# EAGLE design shield (EAGLE 9.6.2)
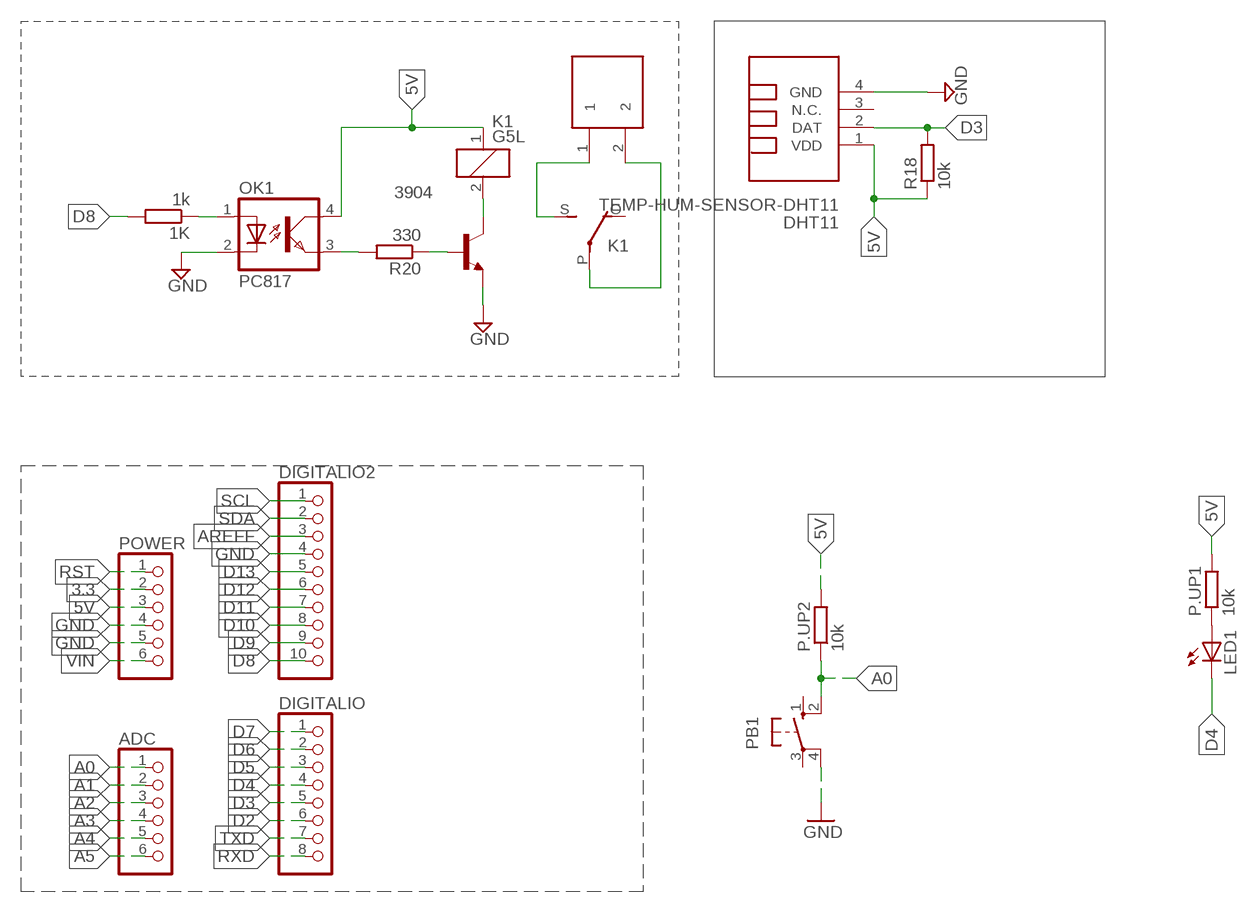
[diagram p0: schematic, sheet 1]

## Parts
1K  1k  R-EU_R0805  [R0805]
3904  MMBT3904LT1-NPN-SOT23-BEC  [SOT23-BEC]
ADC  PINHD-1X6  [1X06]
DHT11  TEMP-HUM-SENSOR-DHT11  [TEMP-HUM-SENSOR-DHT11]
DIGITALIO  PINHD-1X8  [1X08]
DIGITALIO2  PINHD-1X10  [1X10]
K1  G5L  [G5LE]
LED1  LED5MM  [LED5MM]
OK1  PC817  [DIL04]
P.UP1  10k  R-EU_R0805  [R0805]
P.UP2  10k  R-EU_R0805  [R0805]
PB1  10-XX  [B3F-10XX]
POWER  PINHD-1X6  [1X06]
R18  10k  R-EU_R0805  [R0805]
R20  330  R-EU_R0805  [R0805]
U$8  TBLOCK2PIN  [2PIN]

## Nets
3.3: POWER.2
5V: DHT11.1(VDD) K1.1 OK1.4(COL) P.UP1.2 P.UP2.2 POWER.3 R18.1
A0: ADC.1 P.UP2.1 PB1.2(S1)
A1: ADC.2
A2: ADC.3
A3: ADC.4
A4: ADC.5
A5: ADC.6
AREFF: DIGITALIO2.3
D2: DIGITALIO.6
D3: DHT11.2(DAT) DIGITALIO.5 R18.2
D4: DIGITALIO.4 LED1.K(C)
D5: DIGITALIO.3
D6: DIGITALIO.2
D7: DIGITALIO.1
D8: 1K.2 DIGITALIO2.10
D9: DIGITALIO2.9
D10: DIGITALIO2.8
D11: DIGITALIO2.7
D12: DIGITALIO2.6
D13: DIGITALIO2.5
GND: 3904.E DHT11.4(GND) DIGITALIO2.4 OK1.2(C) PB1.4(P1) POWER.4 POWER.5
LOAD: K1.P(2:P) U$8.2
N$1: K1.S(2:S) U$8.1
N$2: LED1.A P.UP1.1
N$13: 1K.1 OK1.1(A)
N$14: OK1.3(EMIT) R20.2
N$15: 3904.B R20.1
N$16: 3904.C K1.2
RST: POWER.1
RXD: DIGITALIO.8
SCL: DIGITALIO2.1
SDA: DIGITALIO2.2
TXD: DIGITALIO.7
VIN: POWER.6
Unconnected: DHT11.3(N.C.) K1.O(2:O) PB1.1(S) PB1.3(P)

## Library data of the parts
1K R18 R20 = rcl:R-EU_: RESISTOR, European symbol
3904 = transistor-neu-to92:*-NPN-: NPN Transistror
ADC POWER = pinhead:PINHD-1X6: PIN HEADER
DHT11 = diy-modules:TEMP-HUM-SENSOR-DHT11: DHT11 - digital humidity & temperature sensor DHT11 datasheet available here: https://akizukidenshi.com/download/ds/aosong/DHT11.pdf Click here to find device on ebay.com <http://www.ebay.com/sch/dht11+digital+sensor>
DIGITALIO = pinhead:PINHD-1X8: PIN HEADER
DIGITALIO2 = pinhead:PINHD-1X10: PIN HEADER
K1 = relay:G5L: RELAY 1 x switch, 10 A/120 V AC, 8 A/30 V ADC, Omron; OC_FARNELL: unknown; OC_NEWARK: unknown
LED1 = led:LED: LED OSRAM: - CHIPLED LG R971, LG N971, LY N971, LG Q971, LY Q971, LO R971, LY R971 LH N974, LH R974 LS Q976, LO Q976, LY Q976 LO Q996 - Hyper CHIPLED LW Q18S LB Q993, LB Q99A, LB R99A - SideLED LS A670, LO A670, LY A670, LG A670, LP A670 LB A673, LV A673, LT A673, LW A673 LH A674 LY A675 LS A676, LA A676, LO A676, LY A676, LW A676 LS A679, LY A679, LG A679 - Hyper Micro SIDELED® LS Y876, LA Y876, LO Y876, LY Y876 LT Y87S - SmartLED LW L88C, LW L88S LB L89C, LB L89S, LG L890 LS L89K, LO L89K, LY L89K LS L896, LA L896, LO L896, LY L896 - TOPLED LS T670, LO T670, LY T670, LG T670, LP T670 LSG T670, LSP T670, LSY T670, LOP T670, LYG T670 LG T671, LOG T671, LSG T671 LB T673, LV T673, LT T673, LW T673 LH T674 LS T676, LA T676, LO T676, LY T676, LB T676, LH T676, LSB T676, LW T676 LB T67C, LV T67C, LT T67C, LS T67K, LO T67K, LY T67K, LW E67C LS E67B, LA E67B, LO E67B, LY E67B, LB E67C, LV E67C, LT E67C LW T67C LS T679, LY T679, LG T679 LS T770, LO T770, LY T770, LG T770, LP T770 LB T773, LV T773, LT T773, LW T773 LH T774 LS E675, LA E675, LY E675, LS T675 LS T776, LA T776, LO T776, LY T776, LB T776 LHGB T686 LT T68C, LB T68C - Hyper Mini TOPLED® LB M676 - Mini TOPLED Santana® LG M470 LS M47K, LO M47K, LY M47K Source: http://www.osram.convergy.de LUXEON: - LUMILED® LXK2-PW12-R00, LXK2-PW12-S00, LXK2-PW14-U00, LXK2-PW14-V00 LXK2-PM12-R00, LXK2-PM12-S00, LXK2-PM14-U00 LXK2-PE12-Q00, LXK2-PE12-R00, LXK2-PE12-S00, LXK2-PE14-T00, LXK2-PE14-U00 LXK2-PB12-K00, LXK2-PB12-L00, LXK2-PB12-M00, LXK2-PB14-N00, LXK2-PB14-P00, LXK2-PB14-Q00 LXK2-PR12-L00, LXK2-PR12-M00, LXK2-PR14-Q00, LXK2-PR14-R00 LXK2-PD12-Q00, LXK2-PD12-R00, LXK2-PD12-S00 LXK2-PH12-R00, LXK2-PH12-S00 LXK2-PL12-P00, LXK2-PL12-Q00, LXK2-PL12-R00 Source: www.luxeon.com KINGBRIGHT: KA-3528ASYC Source: www.kingbright.com
OK1 = optocoupler:PC817: SHARP OPTO COUPLER; MPN: PC817X4J000F; OC_FARNELL: 9707727; OC_NEWARK: 97K7059
P.UP1 P.UP2 = resistor:R-EU_: RESISTOR, European symbol
PB1 = switch-omron:10-XX: OMRON SWITCH; MPN: B3F-1000; OC_FARNELL: 176432; OC_NEWARK: 36M3542
U$8 = Terminal Block 1.1mm hole:TBLOCK2PIN

## Board
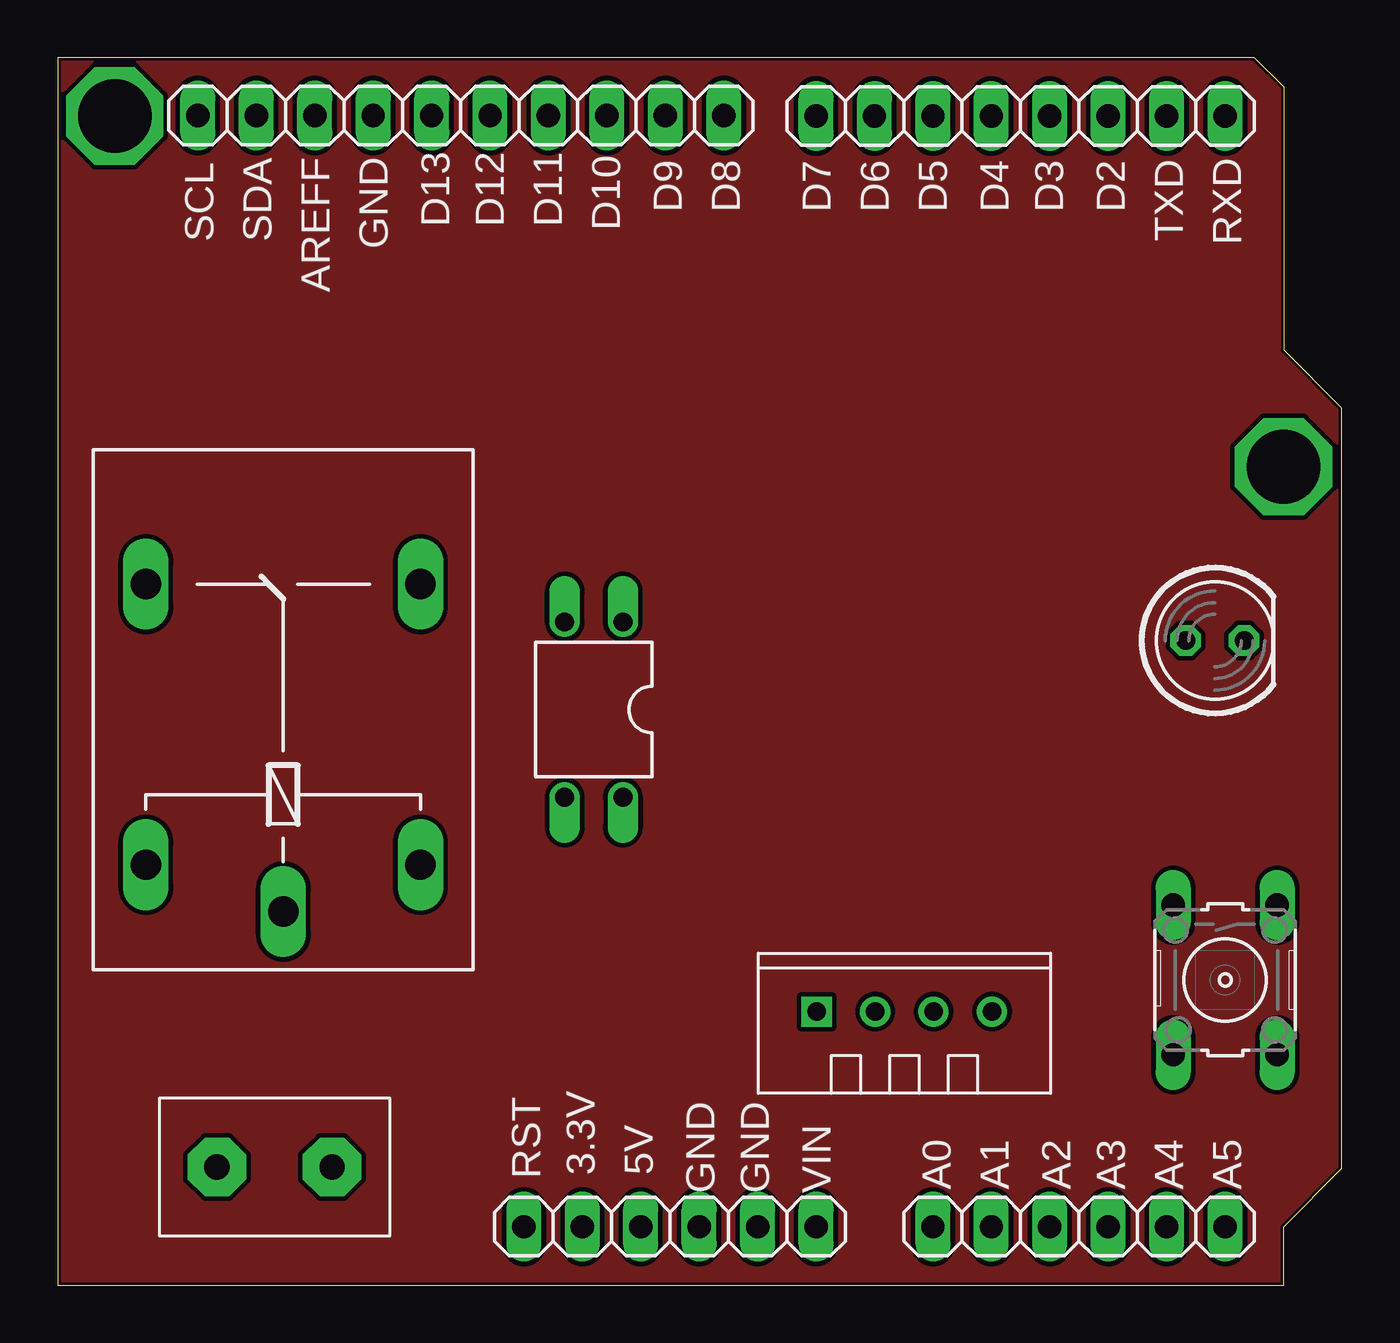
[diagram p1: board, top side]
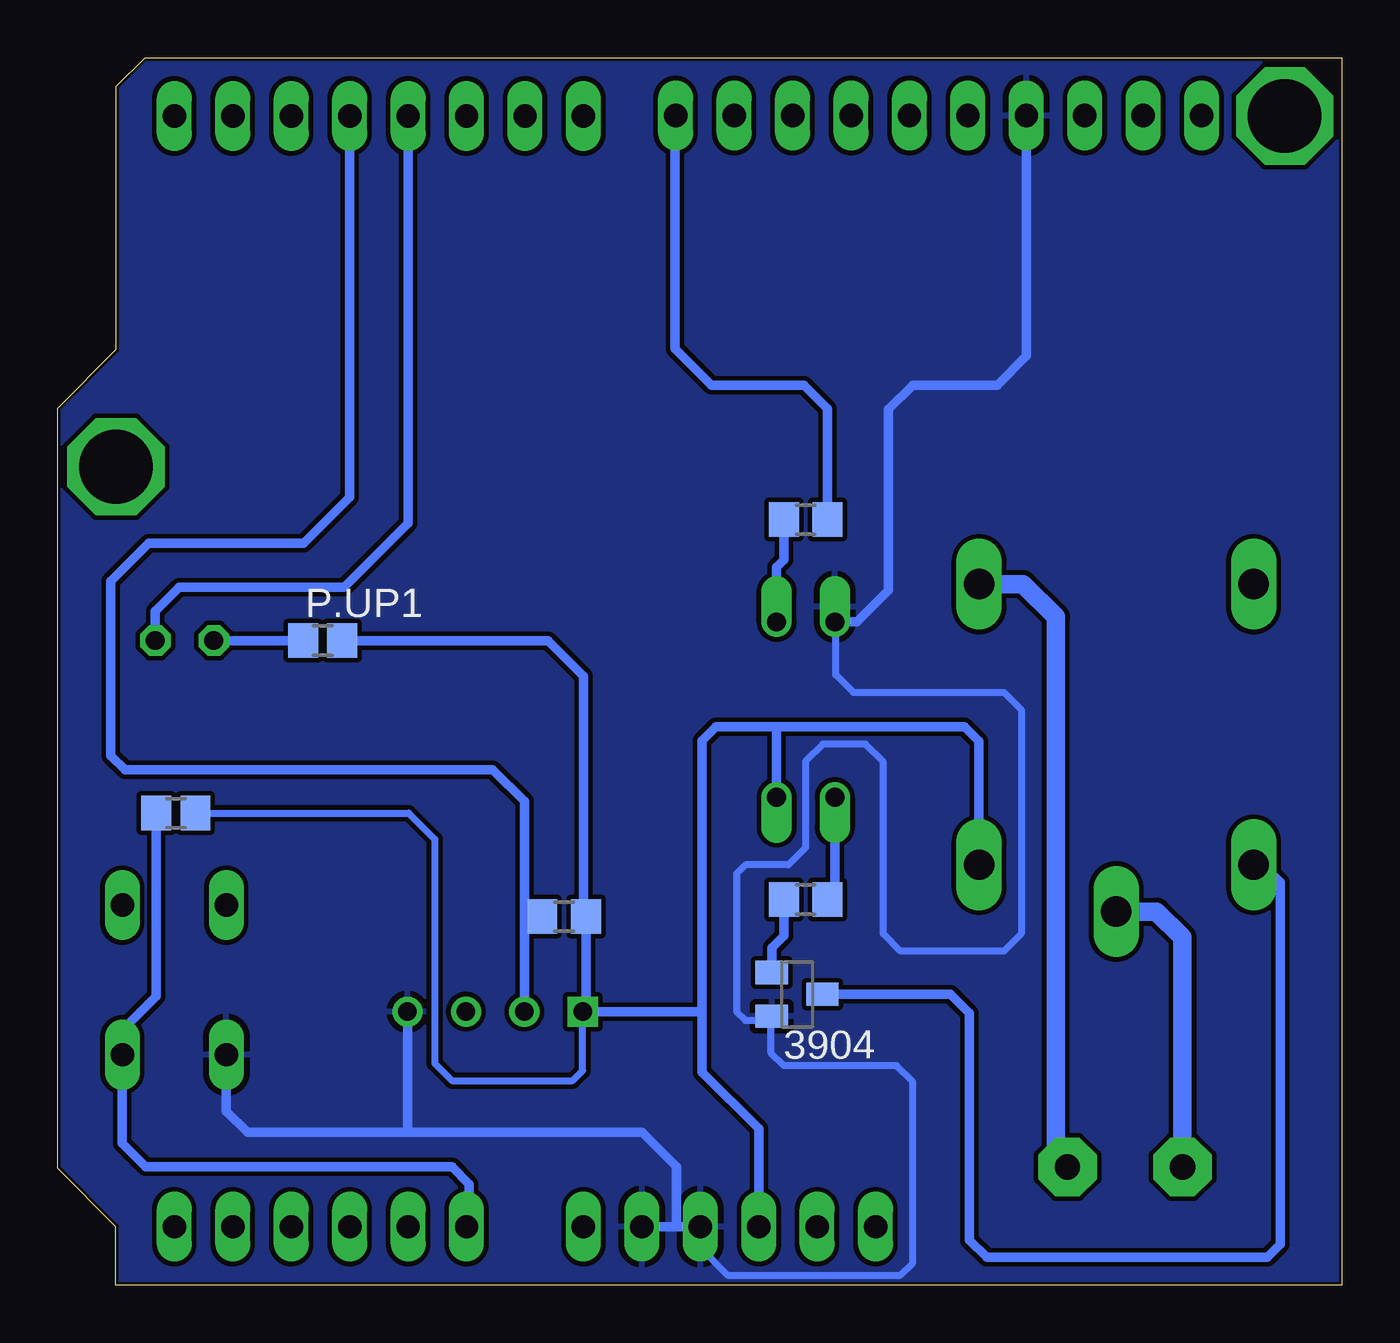
[diagram p2: board, bottom side, seen from below]

Size 55.83 x 53.34 mm. Coordinates in mm from the lower left corner, seen from the top.
Outline: 0,53.34 0,0 53.29,0 53.29,2.54 55.83,5.08 55.83,38.1 53.29,40.64 53.29,52.07 52.02,53.34 0,53.34
Copper layers (1*16): Top 0.035mm / dielectric 1.5mm / Bottom 0.035mm
Design rules "default *": minimum track width 10mil, minimum drill 24mil, track to track 8mil, track to pad 8mil, pad to pad 8mil, via to via 8mil, smd to smd 8mil, copper to edge 5mil, drill to drill 8mil, minimum pad ring 10mil, minimum via ring 8mil, stop-mask expansion 4mil, vias tented up to drill 25mil, thermal gap 10mil

### Footprints (pad centres in the part's own frame; a part is rotated, then mirrored left to right if it is on the bottom)
R0805 = smd 1.3 x 1.5: 1 -0.95,0; 2 0.95,0
SOT23-BEC = smd 1 x 1.4: B -0.95,-1.1; C 0,1.1; E 0.95,-1.1
1X06 = drill 1.016 long: 1 -6.35,0; 2 -3.81,0; 3 -1.27,0; 4 1.27,0; 5 3.81,0; 6 6.35,0
TEMP-HUM-SENSOR-DHT11 = drill 0.8 square: 1 -3.81,0 | drill 0.8: 2 -1.27,0; 3 1.27,0; 4 3.81,0
1X08 = drill 1.016 long: 1 -8.89,0; 2 -6.35,0; 3 -3.81,0; 4 -1.27,0; 5 1.27,0; 6 3.81,0; 7 6.35,0; 8 8.89,0
1X10 = drill 1.016 long: 1 -11.43,0; 2 -8.89,0; 3 -6.35,0; 4 -3.81,0; 5 -1.27,0; 6 1.27,0; 7 3.81,0; 8 6.35,0; 9 8.89,0; 10 11.43,0
G5LE = drill 1.321 long: 1 -7.493,-5.969; 2 -7.493,5.969; O 4.699,5.969; P -9.525,0; S 4.699,-5.969
LED5MM = drill 0.813 octagon: A -1.27,0; K 1.27,0
DIL04 = drill 0.813 offset: 1 -1.27,-3.81; 2 1.27,-3.81; 3 1.27,3.81; 4 -1.27,3.81
R0805' = smd 1.3 x 1.5: 1 -0.85,0; 2 0.85,0
B3F-10XX = drill 1.016 long: 1 -3.251,2.261; 2 3.251,2.261; 3 -3.251,-2.261; 4 3.251,-2.261
2PIN = drill 1.1 pad 2.54 octagon: 1 -2.5,0; 2 2.5,0

### Placement (x,y rotation side)
1K  23.31,33.26 0 bottom
3904  23.69,12.63 270 bottom
ADC  44.4,2.54 0 top
DHT11  36.81,11.88 0 top
DIGITALIO  41.86,50.8 0 top
DIGITALIO2  17.53,50.82 0 top
K1  9.81,25.76 90 top
LED1  50.31,28.01 0 top
OK1  23.31,25.01 180 top
P.UP1  10k  [R0805']  44.31,28.01 0 bottom
P.UP2  10k  [R0805']  50.69,20.51 0 bottom
PB1  50.75,13.26 270 top
POWER  26.62,2.54 0 top
R18  33.81,16.01 180 bottom
R20  23.31,16.76 0 bottom
U$8  9.44,5.13 180 top

### Tracks (layer width: path | path; a pad name or v marks a point on that pad's centre or on a via)
5V
  Bottom 0.305: P.UP2.2 40.56,20.51 39.44,19.38 39.44,9.63 38.69,8.88 33.44,8.88 33,9.32 DHT11.1
  Bottom 0.406: POWER.3 25.35,6.8 27.81,9.26 27.81,11.88 | 27.81,11.88 27.81,23.66 27.21,24.26 24.61,24.26 | 24.61,24.26 16.41,24.26 15.78,23.63 K1.1 | 27.81,11.88 DHT11.1 32.86,12.02 R18.1 32.96,16.11 32.96,26.46 34.51,28.01 P.UP1.2 | OK1.4 24.58,24.23 24.61,24.26
A0
  Bottom 0.406: ADC.1 37.94,2.66 37.94,4.38 38.69,5.13 51.99,5.13 53.01,6.16 PB1.2 53.01,11.08 51.53,12.56 P.UP2.1
D3
  Bottom 0.406: DHT11.2 35.54,16.01 | R18.2 35.54,16.01 | 35.54,16.01 35.54,21.01 36.91,22.38 52.88,22.38 53.51,23.01 53.51,30.59 51.86,32.23 45.13,32.23 43.13,34.24 DIGITALIO.5
D4
  Bottom 0.406: DIGITALIO.4 40.59,33.1 43.37,30.32 50.55,30.32 51.58,29.29 LED1.K
D7
  Bottom 0.406: 33.06,50.71 DIGITALIO.1
D8
  Bottom 0.406: DIGITALIO2.10 28.99,50.79 28.99,40.68 27.41,39.11 23.39,39.11 22.36,38.09 1K.2
GND
  Bottom 0.305: OK1.2 22,28.77 22,26.52 21.23,25.76 14.69,25.76 13.94,25.01 13.94,15.26 14.69,14.51 19.19,14.51 19.94,15.26 19.94,22.73 20.71,23.51 22.56,23.51 23.31,22.76 23.31,19.01 24.06,18.26 25.94,18.26 26.31,17.88 26.31,11.88 25.94,11.51 24.96,11.51 24.81,11.66 | 24.81,11.66 3904.E | POWER.4 27.89,1.61 26.71,0.43 19.19,0.43 18.66,0.96 18.66,8.84 19.36,9.53 24.26,9.53 24.81,10.09 24.81,11.66
  Bottom 0.406: POWER.4 28.94,2.54 | 28.94,2.54 POWER.5 | PB1.4 48.49,7.56 47.57,6.63 40.56,6.63 | 40.56,6.63 30.44,6.63 28.94,5.13 28.94,2.54 | DHT11.4 40.62,6.7 40.56,6.63 | OK1.2 21.08,28.82 19.71,30.18 19.71,38.06 18.66,39.11 14.98,39.11 13.72,40.37 DIGITALIO2.4
  pour Bottom (isolate 0.406): 0.06,-0.12 53.31,-0.12 53.31,2.51 55.94,5.13 55.94,38.13 53.31,40.76 53.31,52.01 51.81,53.51 0.06,53.51
  pour Bottom: 0.11,39.11 0.11,-0.09 53.31,-0.09 53.31,2.53 55.94,5.16 55.94,38.06 53.31,40.68 53.31,52.06 52.09,53.29 0.11,53.29
LOAD
  Bottom 0.813: K1.P 8.06,16.23 6.94,15.11 U$8.2
N$1
  Bottom 0.813: U$8.1 12.44,6.01 12.44,29.04 13.86,30.46 K1.S
N$2
  Bottom 0.406: LED1.A P.UP1.1
N$3
  pour Top: 0.11,-0.09 53.31,-0.09 53.31,2.36 53.31,2.53 55.94,5.16 55.94,38.06 53.31,40.68 53.31,52.06 52.09,53.29 0.11,53.29
N$5  (via drill 3.2)
  other vias: 2.49,50.8
N$10  (via drill 3.2)
  other vias: 53.29,35.56
N$13
  Bottom 0.406: OK1.1 24.58,31.19 24.26,31.51 1K.1
N$14
  Bottom 0.406: 22.04,19.9 OK1.3 22.04,17.08 R20.2
N$15
  Bottom 0.406: R20.1 24.26,15.18 24.78,14.66 3904.B
N$16
  Bottom 0.406: 3904.C 17.01,12.63 16.19,11.81 16.19,1.96 15.44,1.22 3.25,1.22 2.69,1.78 2.69,17.51 3.44,18.27 K1.2

### Text on the board
tPlace: D9 | D8 | D7 | D6 | D5 | D4 | D3 | D2 | D13 | D12 | D11 | D10 | SCL | SDA | GND | TXD | RXD | AREFF | RST | 3.3V | 5V | GND | GND | VIN | A0 | A1 | A2 | A3 | A4 | A5
tStop: WORKSHOP / SH-202 | RELAY D8 | LED D4 | BTN A0 | DHT D3 | AC LOAD